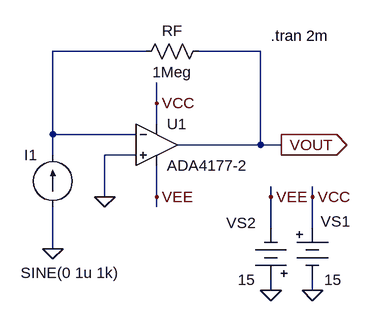
[diagram p0: schematic fig-01-02-23.asc]
fig-01-02-23.asc, the LTspice schematic file:
Version 4
SHEET 1 880 680
WIRE 192 32 48 32
WIRE 368 32 272 32
WIRE 208 112 208 80
WIRE 208 144 208 112
WIRE 48 160 48 32
WIRE 176 160 48 160
WIRE 368 176 368 32
WIRE 368 176 240 176
WIRE 400 176 368 176
WIRE 48 192 48 160
WIRE 176 192 128 192
WIRE 128 256 128 192
WIRE 208 256 208 208
WIRE 384 256 384 240
WIRE 448 256 448 240
WIRE 208 272 208 256
WIRE 384 304 384 256
WIRE 448 304 448 256
WIRE 48 336 48 272
WIRE 384 400 384 384
WIRE 448 400 448 384
FLAG 128 256 0
FLAG 48 336 0
FLAG 400 176 VOUT
IOPIN 400 176 Out
FLAG 384 400 0
FLAG 448 400 0
FLAG 384 256 VEE
FLAG 448 256 VCC
FLAG 208 112 VCC
FLAG 208 256 VEE
SYMBOL res 288 16 R90
WINDOW 0 0 56 VBottom 2
WINDOW 3 32 56 VTop 2
SYMATTR InstName RF
SYMATTR Value 1Meg
SYMBOL current 48 272 R180
WINDOW 0 24 80 Left 2
WINDOW 3 -102 -101 Left 2
WINDOW 123 0 0 Left 0
WINDOW 39 0 0 Left 0
SYMATTR InstName I1
SYMATTR Value SINE(0 1u 1k)
SYMBOL Misc\\battery 448 288 R0
WINDOW 0 13 6 Left 2
WINDOW 3 18 96 Left 2
SYMATTR InstName VS1
SYMATTR Value 15
SYMBOL Misc\\battery 384 400 R180
WINDOW 0 24 104 Left 2
WINDOW 3 24 16 Left 2
SYMATTR InstName VS2
SYMATTR Value 15
SYMBOL Opamps\\ADA4177-2 208 176 R0
SYMATTR InstName U1
TEXT 384 8 Left 2 !.tran 2m

The netlist it stands for:
* fig-01-02-23.asc
RF VOUT N001 1Meg
I1 0 N001 SINE(0 1u 1k)
VS1 VCC 0 15
VS2 0 VEE 15
* U1: ADA4177-2 (symbol Opamps\ADA4177-2 not available, pins judged from their places): In+=0 In-=N001 V+=VCC V-=VEE OUT=VOUT
.tran 2m
.backanno
.end